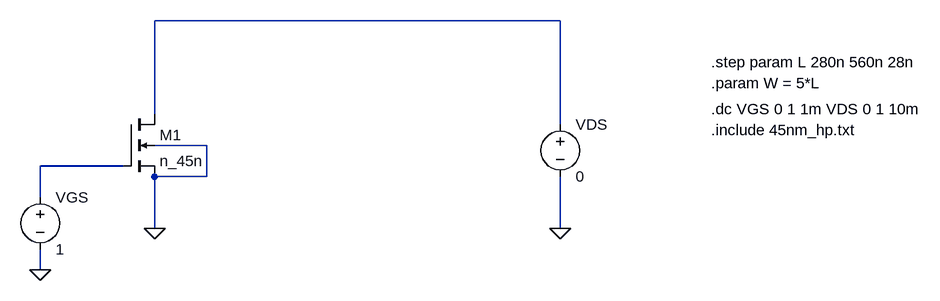
[diagram p0: schematic intrinsic_extract.asc]
intrinsic_extract.asc, the LTspice schematic file:
Version 4
SHEET 1 1420 680
WIRE 656 -64 32 -64
WIRE 32 80 32 -64
WIRE 656 96 656 -64
WIRE 112 128 32 128
WIRE -16 160 -144 160
WIRE 112 176 112 128
WIRE 112 176 32 176
WIRE -144 208 -144 160
WIRE 32 256 32 176
WIRE 656 256 656 176
WIRE -144 320 -144 288
FLAG -144 320 0
FLAG 656 256 0
FLAG 32 256 0
SYMBOL nmos4 -16 80 R0
SYMATTR InstName M1
SYMATTR Value n_45n
SYMATTR Value2 l={L} w={W}
SYMBOL voltage -144 192 R0
WINDOW 123 0 0 Left 0
WINDOW 39 0 0 Left 0
SYMATTR InstName VGS
SYMATTR Value 1
SYMBOL voltage 656 80 R0
WINDOW 123 0 0 Left 0
WINDOW 39 0 0 Left 0
SYMATTR InstName VDS
SYMATTR Value 0
TEXT 888 32 Left 2 !.param W = 5*L
TEXT 888 0 Left 2 !.step param L 280n 560n 28n
TEXT 888 72 Left 2 !.dc VGS 0 1 1m VDS 0 1 10m
TEXT 888 104 Left 2 !.include 45nm_hp.txt

The netlist it stands for:
* intrinsic_extract.asc
M1 N001 N002 0 0 n_45n l={L} w={W}
VGS N002 0 1
VDS N001 0 0
.model NMOS NMOS
.model PMOS PMOS
.lib standard.mos
.param W = 5*L
.step param L 280n 560n 28n
.dc VGS 0 1 1m VDS 0 1 10m
.include 45nm_hp.txt
.backanno
.end